# Altium project LimeSDR-USB_1v4.PrjPcb (part 5 of 7)

## Sheet 13_USB3_0_power.SchDoc: USB3.0 power
size A4; Organization: Lime Microsystems; Address1: Surrey Tech Centre; Address2: Guildford GU2 7YG; Address3: Surray; Address4: United Kingdom; Revision: v1.4; SheetNumber: 13; SheetTotal: 15
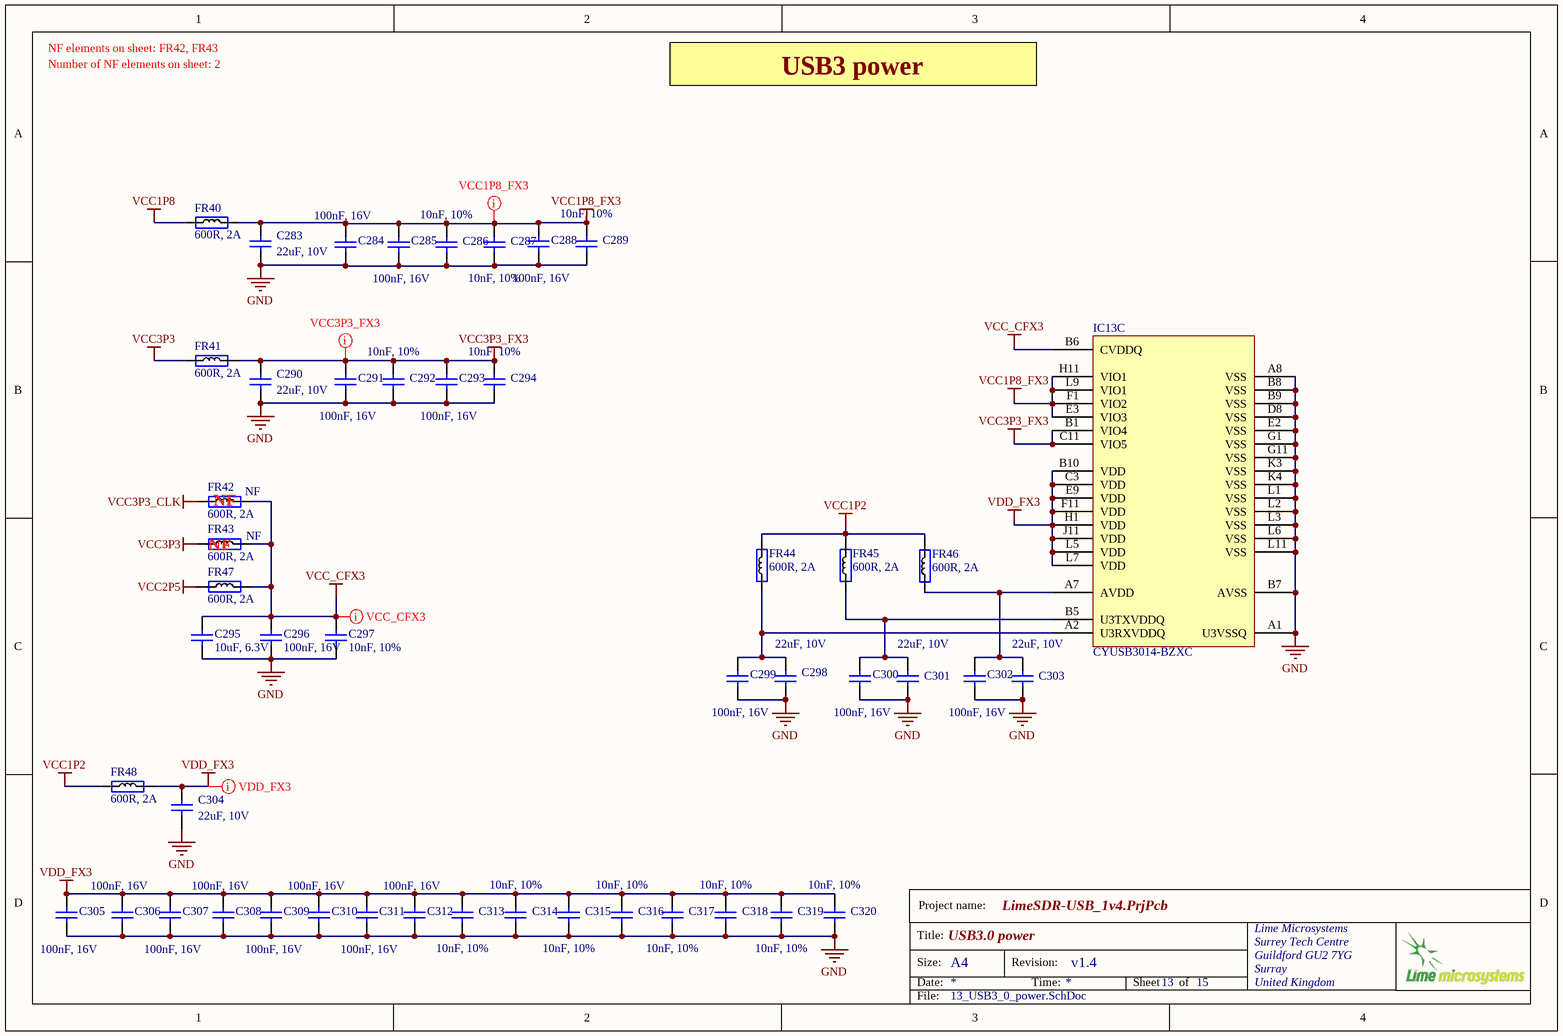
[diagram p12: 13_USB3_0_power.SchDoc]

### Parts
C283  22uF, 10V  [CAP0603]
C284  100nF, 16V  [CAP0402]
C285  100nF, 16V  [CAP0402]
C286  10nF, 10%  [CAP0402]
C287  10nF, 10%  [CAP0402]
C288  100nF, 16V  [CAP0402]
C289  10nF, 10%  [CAP0402]
C290  22uF, 10V  [CAP0603]
C291  100nF, 16V  [CAP0402]
C292  10nF, 10%  [CAP0402]
C293  100nF, 16V  [CAP0402]
C294  10nF, 10%  [CAP0402]
C295  10uF, 6.3V  [CAP0603]
C296  100nF, 16V  [CAP0402]
C297  10nF, 10%  [CAP0402]
C298  22uF, 10V  [CAP0603]
C299  100nF, 16V  [CAP0402]
C300  100nF, 16V  [CAP0402]
C301  22uF, 10V  [CAP0603]
C302  100nF, 16V  [CAP0402]
C303  22uF, 10V  [CAP0603]
C304  22uF, 10V  [CAP0603]
C305  100nF, 16V  [CAP0402]
C306  100nF, 16V  [CAP0402]
C307  100nF, 16V  [CAP0402]
C308  100nF, 16V  [CAP0402]
C309  100nF, 16V  [CAP0402]
C310  100nF, 16V  [CAP0402]
C311  100nF, 16V  [CAP0402]
C312  100nF, 16V  [CAP0402]
C313  10nF, 10%  [CAP0402]
C314  10nF, 10%  [CAP0402]
C315  10nF, 10%  [CAP0402]
C316  10nF, 10%  [CAP0402]
C317  10nF, 10%  [CAP0402]
C318  10nF, 10%  [CAP0402]
C319  10nF, 10%  [CAP0402]
C320  10nF, 10%  [CAP0402]
FR40  600R, 2A  [RES0805]
FR41  600R, 2A  [RES0805]
FR42  600R, 2A  Assembly Info: NF  [RES0805]
FR43  600R, 2A  Assembly Info: NF  [RES0805]
FR44  600R, 2A  [RES0805]
FR45  600R, 2A  [RES0805]
FR46  600R, 2A  [RES0805]
FR47  600R, 2A  [RES0805]
FR48  600R, 2A  [RES0805]
IC13  CYUSB3014-BZXC  [CYP-BZX121]  (part C of 3)

### Nets
GND: C283.1 C284.2 C285.2 C286.1 C287.1 C288.2 C289.1 C290.1 C291.2 C292.1 C293.2 C294.1 C295.1 C296.2 C297.1 C298.1 C299.2 C300.2 C301.1 C302.2 C303.1 C304.1 C305.2 C306.2 C307.2 C308.2 C309.2 C310.2 C311.2 C312.2 C313.1 C314.1 C315.1 C316.1 C317.1 C318.1 C319.1 C320.1 IC13.A1(U3VSSQ) IC13.A8(VSS) IC13.B7(AVSS) IC13.B8(VSS) IC13.B9(VSS) IC13.D8(VSS) IC13.E2(VSS) IC13.G1(VSS) IC13.G11(VSS) IC13.K3(VSS) IC13.K4(VSS) IC13.L1(VSS) IC13.L2(VSS) IC13.L3(VSS) IC13.L6(VSS) IC13.L11(VSS)
VCC1P2: FR44.2 FR45.2 FR46.2 FR48.1
VCC1P8: FR40.1
VCC1P8_FX3: C283.2 C284.1 C285.1 C286.2 C287.2 C288.1 C289.2 FR40.2 IC13.E3(VIO3) IC13.F1(VIO2) IC13.H11(VIO1) IC13.L9(VIO1)
VCC2P5: FR47.2
VCC3P3: FR41.1 FR43.2
VCC3P3_CLK: FR42.2
VCC3P3_FX3: C290.2 C291.1 C292.2 C293.1 C294.2 FR41.2 IC13.B1(VIO4) IC13.C11(VIO5)
VCC_CFX3: C295.2 C296.1 C297.2 FR42.1 FR43.1 FR47.1 IC13.B6(CVDDQ)
VDD_FX3: C304.2 C305.1 C306.1 C307.1 C308.1 C309.1 C310.1 C311.1 C312.1 C313.2 C314.2 C315.2 C316.2 C317.2 C318.2 C319.2 C320.2 FR48.2 IC13.B10(VDD) IC13.C3(VDD) IC13.E9(VDD) IC13.F11(VDD) IC13.H1(VDD) IC13.J11(VDD) IC13.L5(VDD) IC13.L7(VDD)
NetC298_2: C298.2 C299.1 FR44.1 IC13.A2(U3RXVDDQ)
NetC300_1: C300.1 C301.2 FR45.1 IC13.B5(U3TXVDDQ)
NetC302_1: C302.1 C303.2 FR46.1 IC13.A7(AVDD)

### Layout directives
net class VCC1P8_FX3: VCC1P8_FX3
net class VCC3P3_FX3: VCC3P3_FX3
net class VCC_CFX3: VCC_CFX3
net class VDD_FX3: VDD_FX3

### Notes on the sheet
- Number of NF elements on sheet: 2
- NF elements on sheet: FR42, FR43
- USB3 power
- (near FR42) NF
- (near FR43) NF
- Project name:
- Title:
- Size:
- Date:
- A4
- Revision:
- Time:
- Sheet
- of
- File:

### Library data of the parts
C283 C290 C298 C301 C303 C304 = Cap_0603: Manufacturer Part Number 1: C1608X5R1A226M080AC; Part Description: 22µF ±20% 10V X5R Ceramic Capacitor -55°C ~ 85°C Surface Mount, MLCC 0603 (1608 Metric) 0.063" L x 0.031" W (1.60mm x 0.80mm); Brand: TDK; Temperature Coefficient / Code: +/- 15 %; Tolerance: 20 %; Type: Multilayer Ceramic Chip Capacitor; Supplier 1: Mouser; Supplier Part Number 1: 810-C1608X5R1A226M; Package / Case: 0603 (1608 metric); Category: Multilayer Ceramic Capacitors MLCC - SMD/SMT; Capacitance: 22 uF; Operating Temperature Range: - 55 C to + 85 C; Case Code - in: 0603; Voltage Rating DC: 10 V; Case Code - mm: 1608; Value: 22uF, 10V; Manufacturer: TDK
C284 C285 C288 C291 C293 C296 C299 C300 C302 C305-C312 = Cap_0603: Manufacturer Part Number 1: GRM155R71C104KA88D; Part Description: 0.10µF ±10% 16V X7R Ceramic Capacitor -55°C ~ 125°C Surface Mount, MLCC 0402 (1005 Metric) 0.039" L x 0.020" W (1.00mm x 0.50mm); Brand: Murata Electronics; Tolerance: 10 %; Type: General Purpose MLCC; Capacitance: 0.1 uF; Temperature Coefficient / Code: +/- 15 %; Supplier 1: Mouser; Supplier Part Number 1: 81-GRM155R71C104KA88; Case Code - in: 0402; Manufacturer: Murata Electronics; Category: Multilayer Ceramic Capacitors MLCC - SMD/SMT; Voltage Rating DC: 16 V; Value: 100nF, 16V; Manufacturer Part Number: GRM155R71C104KA88D
C286 C287 C289 C292 C294 C297 C313-C320 = Cap_0603: Part Description: 10000pF ±10% 50V X7R Ceramic Capacitor -55°C ~ 125°C Surface Mount, MLCC 0402 (1005 Metric) 0.039" L x 0.020" W (1.00mm x 0.50mm); Manufacturer: Yageo; Capacitance: 10000pF; Voltage - Rated: 50V; Supplier 1: Digi-Key; Supplier Part Number 1: 311-1349-2-ND; Category: Capacitors; Package / Case: 0402 (1005 Metric); Tolerance: ±10%; Value: 10nF, 10%
C295 = Cap_0603: Manufacturer Part Number 1: CC0603MRX5R5BB106; Part Description: 10µF ±20% 6.3V X5R Ceramic Capacitor -55°C ~ 85°C Surface Mount, MLCC 0603 (1608 Metric) 0.063" L x 0.031" W (1.60mm x 0.80mm); Manufacturer: Yageo; Capacitance: 10µF; Tolerance: ±20%; Supplier 1: Digi-Key; Supplier Part Number 1: 311-1448-2-ND; Package / Case: 0603 (1608 Metric); Category: Capacitors; Voltage - Rated: 6.3V; Value: 10uF, 6.3V
FR40-FR48 = Ferrite: Manufacturer Part Number 1: MPZ2012S601AT000; Manufacturer: TDK Corporation; Part Description: FERRITE BEAD 600 OHM 0805 1LN; DC Resistance (DCR): 100 mOhm Max; Filter Type: Differential Mode - Single; Impedance @ Frequency: 600 Ohm @ 100MHz; Supplier 1: Digi-Key; Supplier Part Number 1: 445-2206-2-ND; Value: 600R, 2A; Category: Filters; Current Rating: 2A; Height (Max): 0.041" (1.05mm); Mounting Type: Surface Mount; Package / Case: 0805 (2012 Metric); Packaging: Tape & Reel (TR); RoHS: RoHS Compliant; Size / Dimension: 0.079" L x 0.049" W (2.00mm x 1.25mm)
IC13 = CYUSB3014-BZXC: EZ-USB(R) FX3: SuperSpeed USB Controller, 512 KB, 60 I/Os, 0 to 70 degC, 121-Pin FBGA (BZX121); Manufacturer: Cypress Semiconductor Corp; CPU Core: ARM926 EJ-S; Max. Operating Voltage (V): 1.25; Memory Architecture: SRAM; Memory Size (KB): 512; Min. Operating Voltage (V): 1.15; No. of I/Os: 60; DatasheetVersion: Rev. *O; PackageVersion: Rev. *D; PackageReference: BZX121; PackageDescription: 121-Ball FBGA, Body 10 x 10 mm, Pitch 0.8 mm; Supplier 1: Digi-Key; Supplier Part Number 1: 428-3182-ND; Supplier 2: Farnell; Supplier Part Number 2: 2355789; Supplier 3: Newark; Supplier Part Number 3: 54W7901; Supplier 4: Mouser; Supplier Part Number 4: 727-CYUSB3014-BZXC; Max. Operating Temp. (degreesC): 70; Min. Operating Temp. (degreesC): 0; RoHS: Pb-Free; Mounting Technology: Surface Mount; Code_JEDEC: PUB 95; PartNumber: CYUSB3014-BZXC; ComponentLink1Description: Manufacturer URL; ComponentLink1URL: http://www.cypress.com/; ComponentLink2Description: Datasheet; ComponentLink2URL: http://www.cypress.com/?docID=49087; ComponentLink3Description: Package Specification; ComponentLink3URL: http://www.cypress.com/?docID=45795; Part Description: EZ-USB(R) FX3: SuperSpeed USB Controller, 512 KB, 60 I/Os, 0 to 70 degC, 121-Pin FBGA (BZX121)

## Sheet 14_Clocks.SchDoc: Clocks
size A3; Organization: Lime Microsystems; Address1: Surrey Tech Centre; Address2: Guildford GU2 7YG; Address3: Surrey; Address4: United Kingdom; Revision: v1.4; SheetNumber: 14; SheetTotal: 15
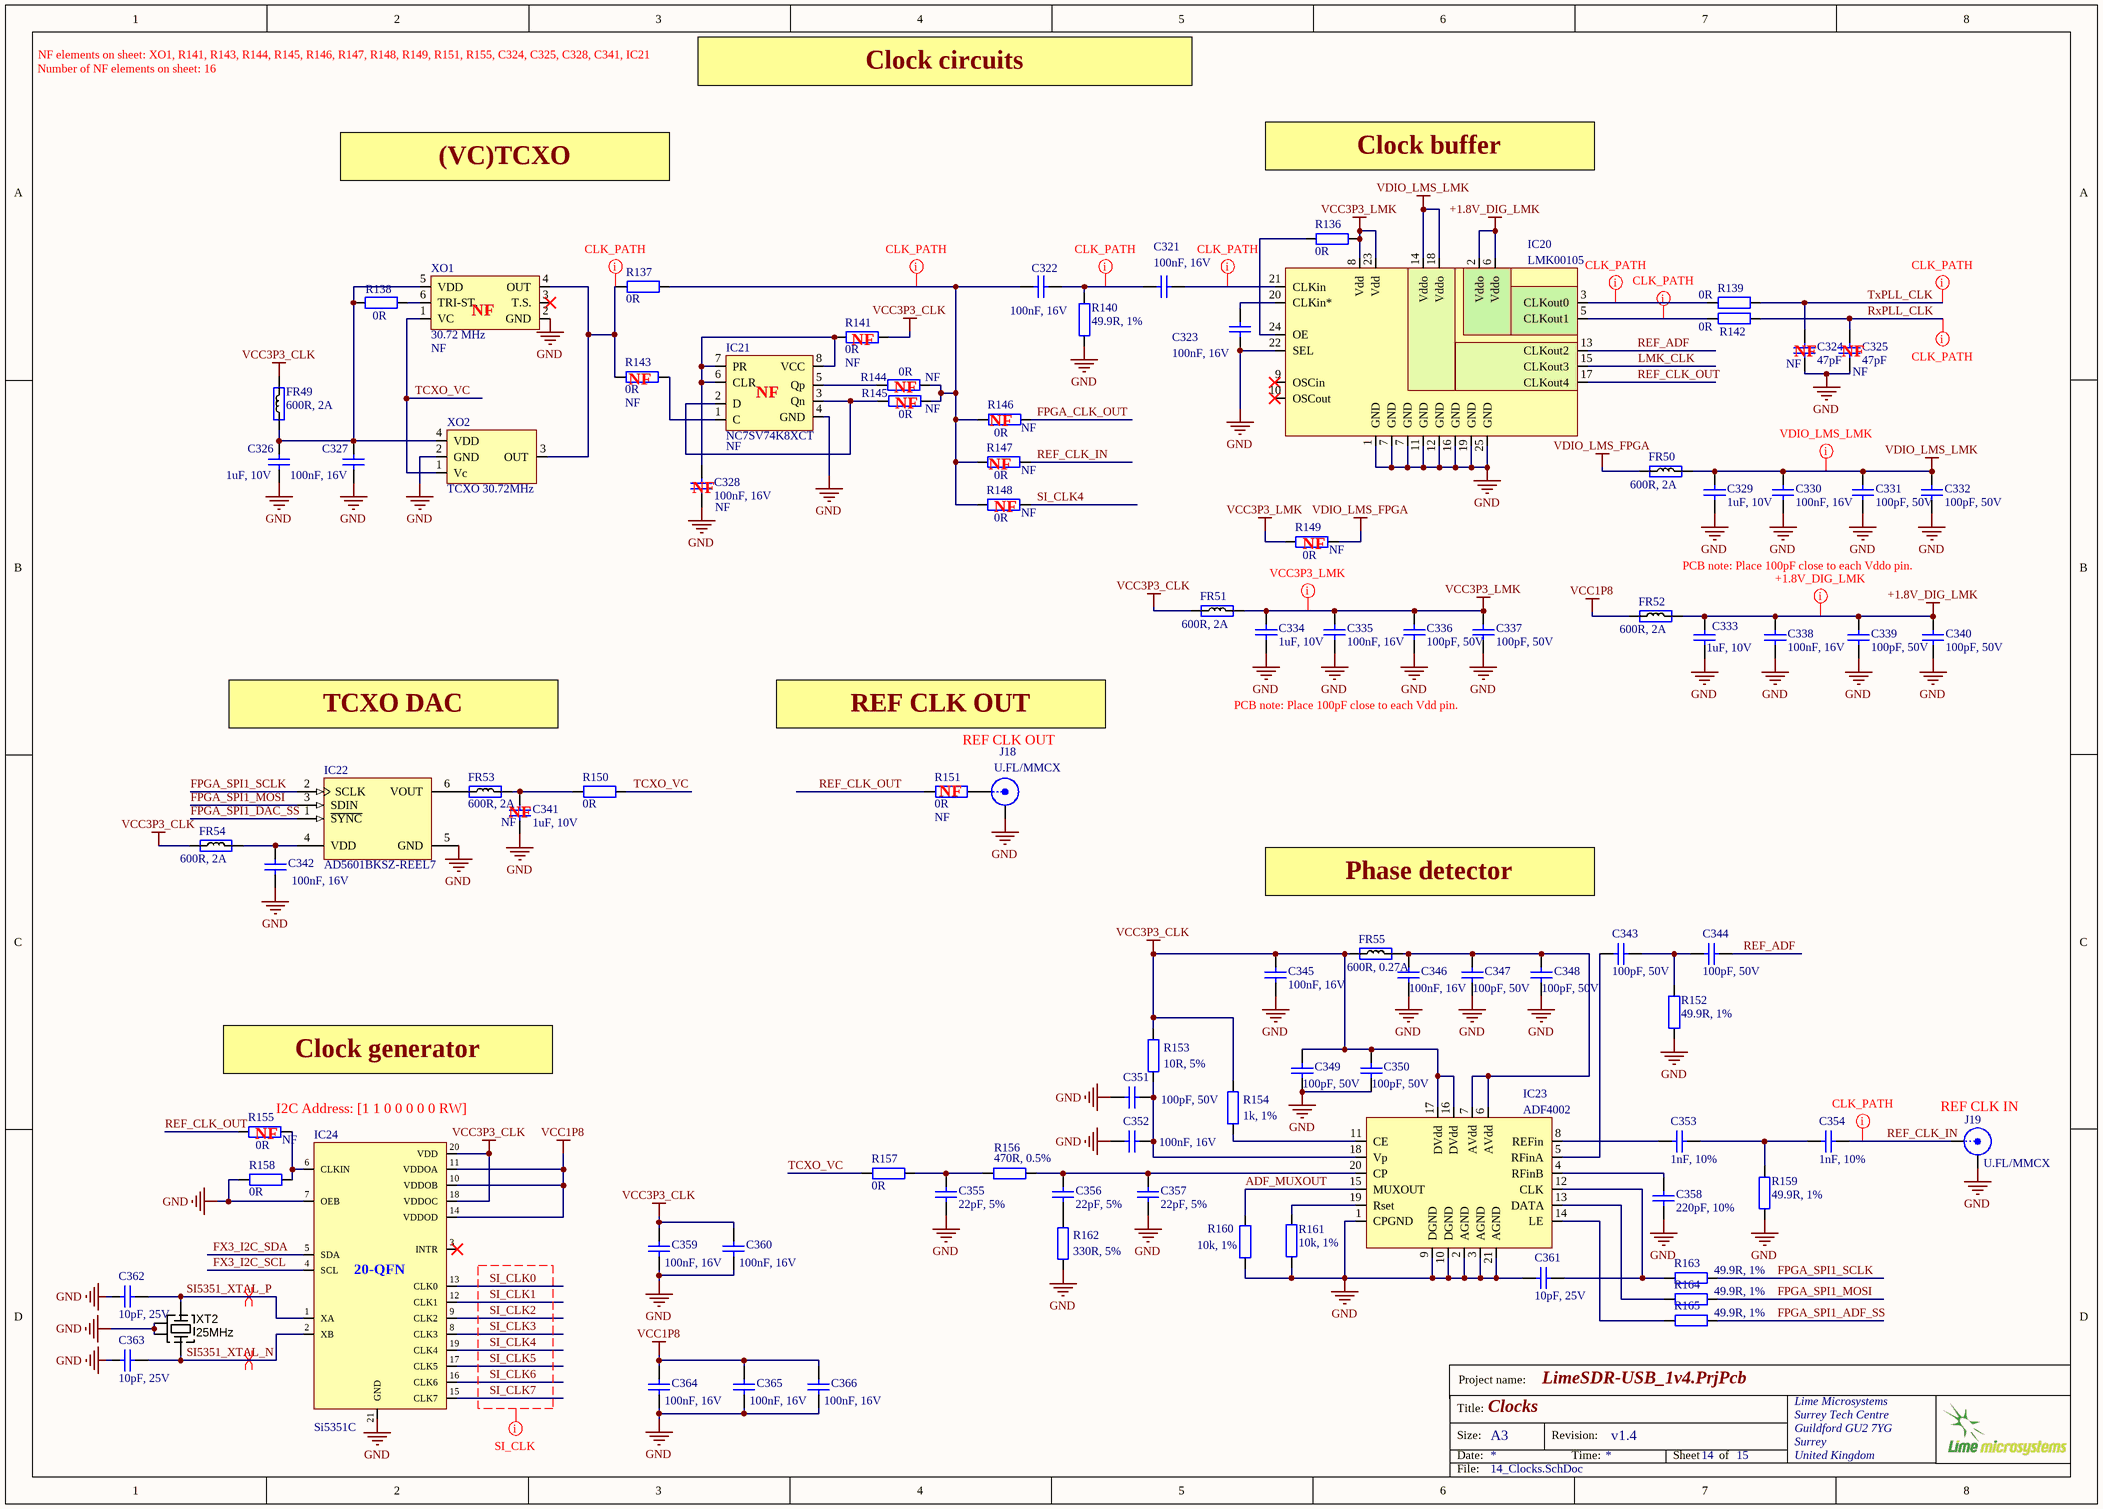
[diagram p13: 14_Clocks.SchDoc]

### Parts
C321  100nF, 16V  [CAP0402]
C322  100nF, 16V  [CAP0402]
C323  100nF, 16V  [CAP0402]
C324  47pF  Assembly Info: NF  [CAP0402]
C325  47pF  Assembly Info: NF  [CAP0402]
C326  1uF, 10V  [CAP0402]
C327  100nF, 16V  [CAP0402]
C328  100nF, 16V  Assembly Info: NF  [CAP0402]
C329  1uF, 10V  [CAP0402]
C330  100nF, 16V  [CAP0402]
C331  100pF, 50V  [CAP0402]
C332  100pF, 50V  [CAP0402]
C333  1uF, 10V  [CAP0402]
C334  1uF, 10V  [CAP0402]
C335  100nF, 16V  [CAP0402]
C336  100pF, 50V  [CAP0402]
C337  100pF, 50V  [CAP0402]
C338  100nF, 16V  [CAP0402]
C339  100pF, 50V  [CAP0402]
C340  100pF, 50V  [CAP0402]
C341  1uF, 10V  Assembly Info: NF  [CAP0402]
C342  100nF, 16V  [CAP0402]
C343  100pF, 50V  [CAP0402]
C344  100pF, 50V  [CAP0402]
C345  100nF, 16V  [CAP0402]
C346  100nF, 16V  [CAP0402]
C347  100pF, 50V  [CAP0402]
C348  100pF, 50V  [CAP0402]
C349  100pF, 50V  [CAP0402]
C350  100pF, 50V  [CAP0402]
C351  100pF, 50V  [CAP0402]
C352  100nF, 16V  [CAP0402]
C353  1nF, 10%  [CAP0402]
C354  1nF, 10%  [CAP0402]
C355  22pF, 5%  [CAP0402]
C356  22pF, 5%  [CAP0402]
C357  22pF, 5%  [CAP0402]
C358  220pF, 10%  [CAP0402]
C359  100nF, 16V  [CAP0402]
C360  100nF, 16V  [CAP0402]
C361  10pF, 25V  [CAP0402]
C362  10pF, 25V  [CAP0402]
C363  10pF, 25V  [CAP0402]
C364  100nF, 16V  [CAP0402]
C365  100nF, 16V  [CAP0402]
C366  100nF, 16V  [CAP0402]
FR49  600R, 2A  [RES0805]
FR50  600R, 2A  [RES0805]
FR51  600R, 2A  [RES0805]
FR52  600R, 2A  [RES0805]
FR53  600R, 2A  [RES0805]
FR54  600R, 2A  [RES0805]
FR55  600R, 0.27A  [RES0201]
IC20  LMK00105  [LMK00105SQ]
IC21  NC7SV74K8XCT  Assembly Info: NF  [NC7SV74K8XCT]
IC22  AD5601BKSZ-REEL7  [AD5601_SOT23-6]
IC23  ADF4002  [ADF4002]
IC24  Si5351C  [Si5351C_20QFN]
J18  U.FL/MMCX  [MMCX_UFL_conn_u]
J19  U.FL/MMCX  [MMCX_UFL_conn_u]
R136  0R  [RES0402]
R137  0R  [RES0402]
R138  0R  [RES0402]
R139  0R  [RES0402]
R140  49.9R, 1%  [RES0402]
R141  0R  Assembly Info: NF  [RES0402]
R142  0R  [RES0402]
R143  0R  Assembly Info: NF  [RES0402]
R144  0R  Assembly Info: NF  [RES0402]
R145  0R  Assembly Info: NF  [RES0402]
R146  0R  Assembly Info: NF  [RES0402]
R147  0R  Assembly Info: NF  [RES0402]
R148  0R  Assembly Info: NF  [RES0402]
R149  0R  Assembly Info: NF  [RES0402]
R150  0R  [RES0402]
R151  0R  Assembly Info: NF  [RES0402]
R152  49.9R, 1%  [RES0402]
R153  10R, 5%  [RES0402]
R154  1k, 1%  [RES0402]
R155  0R  Assembly Info: NF  [RES0402]
R156  470R, 0.5%  [RES0402]
R157  0R  [RES0402]
R158  0R  [RES0402]
R159  49.9R, 1%  [RES0402]
R160  10k, 1%  [RES0402]
R161  10k, 1%  [RES0402]
R162  330R, 5%  [RES0402]
R163  49.9R, 1%  [RES0402]
R164  49.9R, 1%  [RES0402]
R165  49.9R, 1%  [RES0402]
XO1  30.72 MHz  Assembly Info: NF  [RAKON_RPT7050A]
XO2  TCXO 30.72MHz  [RAKON_TXCO]
XT2  25MHz  [CRYSTAL_4-LCC]

### Nets
+1.8V_DIG_LMK: C333.2 C338.2 C339.2 C340.2 FR52.2 IC20.2(Vddo) IC20.6(Vddo)
GND: C323.1 C324.1 C325.1 C326.1 C327.1 C328.1 C329.1 C330.1 C331.1 C332.1 C333.1 C334.1 C335.1 C336.1 C337.1 C338.1 C339.1 C340.1 C341.1 C342.2 C345.1 C346.1 C347.2 C348.2 C349.2 C350.2 C351.1 C352.2 C355.1 C357.1 C358.2 C359.2 C360.2 C361.1 C362.1 C363.1 C364.2 C365.2 C366.2 IC20.1(GND) IC20.7(GND) IC20.11(GND) IC20.12(GND) IC20.16(GND) IC20.19(GND) IC20.22(SEL) IC20.25(GND) IC21.4(GND) IC22.5(GND) IC23.1(CPGND) IC23.2(AGND) IC23.3(AGND) IC23.9(DGND) IC23.10(DGND) IC23.21(AGND) IC24.7(OEB) IC24.21(GND) J18.2(Y) J19.2(Y) R140.1 R152.1 R158.2 R159.1 R160.2 R161.2 R162.1 XO1.2(GND) XO2.2(GND) XT2.2(GND) XT2.4(GND)
VCC1P8: C364.1 C365.1 C366.1 FR52.1 IC24.10(VDDOB) IC24.11(VDDOA) IC24.14(VDDOD)
VCC3P3_CLK: C345.2 C349.1 C350.1 C359.1 C360.1 FR49.2 FR51.1 FR54.1 FR55.1 IC23.16(DVdd) IC23.17(DVdd) IC24.18(VDDOC) IC24.20(VDD) R141.1 R153.2 R154.2
VCC3P3_LMK: C334.2 C335.2 C336.2 C337.2 FR51.2 IC20.8(Vdd) IC20.23(Vdd) R136.2 R149.1
VDIO_LMS_FPGA: FR50.1 R149.2
VDIO_LMS_LMK: C329.2 C330.2 C331.2 C332.2 FR50.2 IC20.14(Vddo) IC20.18(Vddo)
ADF_MUXOUT: IC23.15(MUXOUT) R160.1
FPGA_CLK_OUT: R146.1
FPGA_SPI1_ADF_SS: R165.1
FPGA_SPI1_DAC_SS: IC22.1(~{SYNC})
FPGA_SPI1_MOSI: IC22.3(SDIN) R164.1
FPGA_SPI1_SCLK: IC22.2(SCLK) R163.1
FX3_I2C_SCL: IC24.4(SCL)
FX3_I2C_SDA: IC24.5(SDA)
LMK_CLK: IC20.15(CLKout3)
REF_ADF: C344.2 IC20.13(CLKout2)
REF_CLK_IN: C354.1 J19.1(X) R147.2
REF_CLK_OUT: IC20.17(CLKout4) R151.2 R155.1
RxPLL_CLK: C325.2 R142.1
SI5351_XTAL_N: C363.2 IC24.2(XB) XT2.3(X)
SI5351_XTAL_P: C362.2 IC24.1(XA) XT2.1(X)
SI_CLK0: IC24.13(CLK0)
SI_CLK1: IC24.12(CLK1)
SI_CLK2: IC24.9(CLK2)
SI_CLK3: IC24.8(CLK3)
SI_CLK4: IC24.19(CLK4) R148.2
SI_CLK5: IC24.17(CLK5)
SI_CLK6: IC24.16(CLK6)
SI_CLK7: IC24.15(CLK7)
TCXO_VC: R150.1 R157.2 XO1.1(VC) XO2.1(Vc)
TxPLL_CLK: C324.2 R139.1
NetC321_1: C321.1 IC20.21(CLKin)
NetC321_2: C321.2 C322.1 R140.2
NetC322_2: C322.2 R137.1 R144.1 R145.1 R146.2 R147.1 R148.1
NetC323_2: C323.2 IC20.20(CLKin*)
NetC326_2: C326.2 C327.2 FR49.1 R138.2 XO1.5(VDD) XO2.4(VDD)
NetC328_2: C328.2 IC21.6(CLR) IC21.7(PR) IC21.8(VCC) R141.2
NetC341_2: C341.2 FR53.2 R150.2
NetC342_1: C342.1 FR54.2 IC22.4(VDD)
NetC343_1: C343.1 IC23.5(RFinA)
NetC343_2: C343.2 C344.1 R152.2
NetC346_2: C346.2 C347.1 C348.1 FR55.2 IC23.6(AVdd) IC23.7(AVdd)
NetC351_2: C351.2 C352.1 IC23.18(Vp) R153.1
NetC353_1: C353.1 C354.2 R159.2
NetC353_2: C353.2 IC23.8(REFin)
NetC355_2: C355.2 R156.2 R157.1
NetC356_1: C356.1 R162.2
NetC356_2: C356.2 C357.2 IC23.20(CP) R156.1
NetC358_1: C358.1 IC23.4(RFinB)
NetC361_2: C361.2 IC23.12(CLK) R163.2
NetFR53_1: FR53.1 IC22.6(VOUT)
NetIC20_3: IC20.3(CLKout0) R139.2
NetIC20_5: IC20.5(CLKout1) R142.2
NetIC20_24: IC20.24(OE) R136.1
NetIC21_1: IC21.1(C) R143.1
NetIC21_2: IC21.2(D) IC21.3(Qn) R145.2
NetIC21_5: IC21.5(Qp) R144.2
NetIC23_11: IC23.11(CE) R154.1
NetIC23_13: IC23.13(DATA) R164.2
NetIC23_14: IC23.14(LE) R165.2
NetIC23_19: IC23.19(Rset) R161.1
NetIC24_6: IC24.6(CLKIN) R155.2 R158.1
NetJ18_1: J18.1(X) R151.1
NetR137_2: R137.2 R143.2 XO1.4(OUT) XO2.3(OUT)
NetR138_1: R138.1 XO1.6(TRI-ST.)

Not connected (* = marked no-connect by the designer): IC20 9(OSCin)* 10(OSCout)*; IC24 3(INTR)*; XO1 3(T.S.)*

### Layout directives
net class CLK_PATH: NetC321_1, NetC321_2, NetC322_2, NetIC20_3, NetIC20_5, NetR137_2, REF_CLK_IN, RxPLL_CLK, TxPLL_CLK
net class SI_CLK: SI_CLK0, SI_CLK1, SI_CLK2, SI_CLK3, SI_CLK4, SI_CLK5, SI_CLK6, SI_CLK7
differential pair: SI5351_XTAL_N, SI5351_XTAL_P
net class VDIO_LMS_LMK: VDIO_LMS_LMK
net class VCC3P3_LMK: VCC3P3_LMK
net class +1.8V_DIG_LMK: +1.8V_DIG_LMK

### Notes on the sheet
- Number of NF elements on sheet: 16
- NF elements on sheet: XO1, R141, R143, R144, R145, R146, R147, R148, R149, R151, R155, C324, C325, C328, C341, IC21
- Clock circuits
- (VC)TCXO
- Clock buffer
- (near XO1) NF
- (near R143) NF
- (near R141) NF
- (near C324) NF
- (near C325) NF
- (near IC21) NF
- NF
- (near R145) NF
- (near R146) NF
- (near C328) NF
- (near R147) NF
- (near R148) NF
- (near R149) NF
- PCB note: Place 100pF close to each Vddo pin.
- PCB note: Place 100pF close to each Vdd pin.
- TCXO DAC
- REF CLK OUT
- (near C341) NF
- (near R151) NF
- Phase detector
- Clock generator
- (near R155) I2C Address: [1 1 0 0 0 0 0 RW]
- (near J19) REF CLK IN
- (near R155) NF
- Project name:
- Title:
- Size:
- Date:
- A3
- Revision:
- Time:
- Sheet
- of
- File:
- (in symbol Si5351C) 20-QFN

### Library data of the parts
C321-C323 C327 C328 C330 C335 C338 C345 C346 C352 = Cap_0402: Manufacturer: Murata Electronics; Manufacturer Part Number: GRM155R71C104KA88D; Part Description: 0.10µF ±10% 16V X7R Ceramic Capacitor -55°C ~ 125°C Surface Mount, MLCC 0402 (1005 Metric) 0.039" L x 0.020" W (1.00mm x 0.50mm); Tolerance: 10 %; Type: General Purpose MLCC; Capacitance: 0.1 uF; Case Length: 1 mm; Dielectric: X7R; Case Height: 0.5 mm; Temperature Coefficient / Code: +/- 15 %; Value: 100nF, 16V; Supplier 1: Mouser; Supplier Part Number 1: 81-GRM155R71C104KA88; Case Code - in: 0402; RoHS: RoHS Compliant; Operating Temperature Range: - 55 C to + 125 C; Series: GRM; Termination Style: SMD/SMT; Package / Case: 0402 (1005 metric); Voltage Rating DC: 16 V; Maximum Operating Temperature: + 125 C; Case Code - mm: 1005; Minimum Operating Temperature: - 55 C; Product Category: Low & Medium Capacitance SMD Ceramic Chip Capacitors; Packaging: Reel; Product: General Type MLCCs; Category: Multilayer Ceramic Capacitors MLCC - SMD/SMT; Brand: Murata Electronics; Case Width: 0.5 mm; RoHS - Mouser: Y; Standard Pack Qty: 10000; Minimum Order Quantity: 1; Reeling: True; Manufacturer Part Number 1: GRM155R71C104KA88D
C324 C325 = Cap_0402: Manufacturer Part Number 1: C1005C0G1H470F050BA; Manufacturer: TDK Corporation; Part Description: 47pF ±1% 50V C0G, NP0 Ceramic Capacitor -55°C ~ 125°C Surface Mount, MLCC 0402 (1005 Metric) 0.039" L x 0.020" W (1.00mm x 0.50mm); Voltage - Rated: 50V; Temperature Coefficient: C0G, NP0; Tolerance: ±1%; Value: 47pF; Supplier 1: Digi-Key; Supplier Part Number 1: 445-5361-1-ND; Package / Case: 0402 (1005 Metric); Lead Spacing: -; Ratings: -; Mounting Type: Surface Mount, MLCC; Operating Temperature: -55°C ~ 125°C; Thickness (Max): 0.022" (0.55mm); Capacitance: 47pF; Packaging: Cut Tape (CT); Features: -; Applications: General Purpose; Lead Style: -; Size / Dimension: 0.039" L x 0.020" W (1.00mm x 0.50mm); Height - Seated (Max): -; RoHS: RoHS Compliant; Category: Capacitors
C326 C329 C333 C334 C341 = Cap_0402: Manufacturer Part Number 1: GRM155R61A105KE15J; Manufacturer: TDK; Part Description: 1µF ±10% 10V X5R Ceramic Capacitor -55°C ~ 85°C Surface Mount, MLCC 0402 (1005 Metric) 0.039" L x 0.020" W (1.00mm x 0.50mm); Voltage Rating: 10; Capacitance Tolerance: ± 10%; Product Range: TDK - C Series; Ceramic Capacitor Case: 0402 [1005 Metric]; Capacitance: 1; Dielectric Characteristic: X6; Value: 1uF, 10V; Supplier 1: Newark; Supplier Part Number 1: 490-6298-2-ND; MSL: -; RoHS: YES
C331 C332 C336 C337 C339 C340 = Cap_0402: Manufacturer Part Number 1: CC0402JRNPO9BN101; Manufacturer: Yageo; Part Description: 100pF ±5% 50V C0G, NP0 Ceramic Capacitor -55°C ~ 125°C Surface Mount, MLCC 0402 (1005 Metric) 0.039" L x 0.020" W (1.00mm x 0.50mm); Temperature Coefficient: C0G, NP0; Tolerance: ±5%; Value: 100pF, 50V; Supplier 1: Digi-Key; Supplier Part Number 1: 311-1024-1-ND; RoHS: RoHS Compliant; Category: Capacitors; Applications: General Purpose; Mounting Type: Surface Mount, MLCC; Capacitance: 100pF; Ratings: -; Packaging: Cut Tape (CT); Voltage - Rated: 50V; Size / Dimension: 0.039" L x 0.020" W (1.00mm x 0.50mm); Height - Seated (Max): -; Package / Case: 0402 (1005 Metric); Operating Temperature: -55°C ~ 125°C; Features: -; Lead Spacing: -; Lead Style: -; Thickness (Max): 0.022" (0.55mm)
C342 C359 C360 C364-C366 = Cap_0603: as C284 on sheet 13_USB3_0_power; Supplier 1: Mouser; Supplier Part Number 1: 81-GRM155R71C104KA88; Case Code - in: 0402; Manufacturer: Murata Electronics; Category: Multilayer Ceramic Capacitors MLCC - SMD/SMT; Voltage Rating DC: 16 V; Value: 100nF, 16V; Manufacturer Part Number: GRM155R71C104KA88D
C343 C344 C347-C351 = Cap_0402: Manufacturer: Yageo; Manufacturer Part Number 1: CC0402JRNPO9BN101; Part Description: 100pF ±5% 50V C0G, NP0 Ceramic Capacitor -55°C ~ 125°C Surface Mount, MLCC 0402 (1005 Metric) 0.039" L x 0.020" W (1.00mm x 0.50mm); Temperature Coefficient: C0G, NP0; Tolerance: ±5%; Value: 100pF, 50V; Supplier 1: Digi-Key; Supplier Part Number 1: 311-1024-1-ND; Category: Capacitors; Features: -; Operating Temperature: -55°C ~ 125°C; Capacitance: 100pF; Thickness (Max): 0.022" (0.55mm); RoHS: RoHS Compliant; Voltage - Rated: 50V; Lead Style: -; Ratings: -; Size / Dimension: 0.039" L x 0.020" W (1.00mm x 0.50mm); Height - Seated (Max): -; Applications: General Purpose; Package / Case: 0402 (1005 Metric); Lead Spacing: -; Packaging: Tape & Reel (TR); Mounting Type: Surface Mount, MLCC
C353 C354 = Cap_0402: Manufacturer Part Number 1: GCM155R71H102KA37D; Part Description: 1000pF ±10% 50V X7R Ceramic Capacitor -55°C ~ 125°C Surface Mount, MLCC 0402 (1005 Metric) 0.039" L x 0.020" W (1.00mm x 0.50mm); Capacitance: 1000 pF; Type: Automotive Ultra Small MLCC; Brand: Murata Electronics; Case Height: 0.5 mm; Case Length: 1 mm; Dielectric: X7R; Voltage Rating DC: 50 V; Temperature Coefficient / Code: +/- 15 %; Value: 1nF, 10%; Supplier 1: Mouser; Supplier Part Number 1: 81-GCM155R71H102KA7D; Case Code - in: 0402; Package / Case: 0402 (1005 metric); Tolerance: 10 %; Termination Style: SMD/SMT; Packaging: Reel; Operating Temperature Range: - 55 C to + 125 C; Maximum Operating Temperature: + 125 C; Manufacturer: Murata Electronics; Category: Multilayer Ceramic Capacitors MLCC - SMD/SMT; RoHS: RoHS Compliant; Series: GCM; Case Width: 0.5 mm; Case Code - mm: 1005; Product: Automotive MLCCs; Standard Pack Qty: 10000; Reeling: True; RoHS - Mouser: Y; Minimum Order Quantity: 1; Product Category: Automotive Ceramic Chip Capacitors; Minimum Operating Temperature: - 55 C
C355-C357 = Cap_0402: Manufacturer: Yageo; Manufacturer Part Number 1: CC0402JRNPO9BN220; Part Description: 22pF ±5% 50V C0G, NP0 Ceramic Capacitor -55°C ~ 125°C Surface Mount, MLCC 0402 (1005 Metric) 0.039" L x 0.020" W (1.00mm x 0.50mm); Voltage - Rated: 50V; Temperature Coefficient: C0G, NP0; Value: 22pF, 5%; Supplier 1: Digi-Key; Supplier Part Number 1: 311-1018-2-ND; Tolerance: ±5%; Category: Capacitors; Packaging: Tape & Reel (TR); RoHS: RoHS Compliant; Capacitance: 22pF; Operating Temperature: -55°C ~ 125°C; Mounting Type: Surface Mount, MLCC; Height - Seated (Max): -; Size / Dimension: 0.039" L x 0.020" W (1.00mm x 0.50mm); Ratings: -; Applications: General Purpose; Thickness (Max): 0.022" (0.55mm); Lead Spacing: -; Lead Style: -; Features: -; Package / Case: 0402 (1005 Metric)
C358 = Cap_0402: Manufacturer Part Number 1: CC0402KRX7R9BB221; Manufacturer: Yageo; Part Description: 220pF ±10% 50V X7R Ceramic Capacitor -55°C ~ 125°C Surface Mount, MLCC 0402 (1005 Metric) 0.039" L x 0.020" W (1.00mm x 0.50mm); Temperature Coefficient: X7R; Voltage - Rated: 50V; Value: 220pF, 10%; Supplier 1: Digi-Key; Supplier Part Number 1: 311-1035-2-ND; Category: Capacitors; Ratings: -; RoHS: RoHS Compliant; Packaging: Tape & Reel (TR); Mounting Type: Surface Mount, MLCC; Applications: General Purpose; Capacitance: 220pF; Tolerance: ±10%; Operating Temperature: -55°C ~ 125°C; Package / Case: 0402 (1005 Metric); Lead Spacing: -; Size / Dimension: 0.039" L x 0.020" W (1.00mm x 0.50mm); Thickness (Max): 0.022" (0.55mm); Height - Seated (Max): -; Lead Style: -; Features: -
C361 = Cap_0402: Manufacturer Part Number 1: 04023A100JAT2A; Manufacturer: AVX; Part Description: 10pF ±5% 25V C0G, NP0 Ceramic Capacitor -55°C ~ 125°C Surface Mount, MLCC 0402 (1005 Metric) 0.039" L x 0.020" W (1.00mm x 0.50mm); Capacitance Tolerance: ± 5%; Voltage Rating: 25; Ceramic Capacitor Case: 0402 [1005 Metric]; Capacitor Case Style: 0402 [1005 Metric]<!--FANDB--><div class="features-and-benefits-container"></div>; Dielectric Characteristic: C0G / NP0; SVHC: No SVHC (16-Jun-2014); Capacitance: 10; Value: 10pF, 25V; Supplier 1: Farnell; Supplier Part Number 1: 2332478RL; Product Range: -; RoHS: YES; Operating Temperature Min: -55; Operating Temperature Max: 125; Capacitance Tolerance ±: ± 5%; MSL: MSL 1 - Unlimited; Packaging: Cut Tape
C362 C363 = Cap_0402: Manufacturer: AVX; Part Description: 10pF ±5% 25V C0G, NP0 Ceramic Capacitor -55°C ~ 125°C Surface Mount, MLCC 0402 (1005 Metric) 0.039" L x 0.020" W (1.00mm x 0.50mm); Capacitance: 10; Ceramic Capacitor Case: 0402 [1005 Metric]; Capacitance Tolerance: ± 5%; Supplier 1: Farnell; Supplier Part Number 1: 2332478RL; value: 10pF, 25V
FR49-FR54 = Ferrite: Manufacturer Part Number 1: MPZ2012S601AT000; Manufacturer: TDK Corporation; Part Description: FERRITE BEAD 600 OHM 0805 1LN; Filter Type: Differential Mode - Single; Impedance @ Frequency: 600 Ohm @ 100MHz; DC Resistance (DCR): 100 mOhm Max; Supplier 1: Digi-Key; Supplier Part Number 1: 445-2206-2-ND; Mounting Type: Surface Mount; RoHS: RoHS Compliant; Height (Max): 0.041" (1.05mm); Packaging: Tape & Reel (TR); Category: Filters; Current Rating: 2A; Package / Case: 0805 (2012 Metric); Size / Dimension: 0.079" L x 0.049" W (2.00mm x 1.25mm); Value: 600R, 2A
FR55 = Ferrite: Manufacturer Part Number 1: BK0603TS601-T; Manufacturer: Taiyo Yuden; Part Description: FERRITE BEAD 600 OHM 0201 1LN; DC Resistance (DCR): 750 mOhm Max; Filter Type: Differential Mode - Single; Impedance @ Frequency: 600 Ohm @ 100MHz; Current Rating: 270mA; Supplier 1: Digi-Key; Supplier Part Number 1: 587-3277-1-ND; Size / Dimension: 0.024" L x 0.012" W (0.60mm x 0.30mm); Package / Case: 0201 (0603 Metric); Height (Max): 0.013" (0.33mm); Mounting Type: Surface Mount; Packaging: Cut Tape (CT); RoHS: RoHS Compliant; Category: Filters; Value: 600R, 0.27A
IC20 = LMK00105: Manufacturer: Texas Instruments; Manufacturer Part Number 1: LMK00105SQ/NOPB; Part Description: IC CLK BUFFER 2:5 200MHZ 24WQFN; Frequency - Max: 200MHz; Voltage - Supply: 2.375 V ~ 3.45 V; Input: HCSL, LVCMOS, LVDS, LVPECL, LVTTL, SSTL, Crystal; Differential - Input:Output: Yes/No; Supplier 1: Digi-Key; Type: Fanout Buffer (Distribution), Multiplexer, Translator; Category: Integrated Circuits (ICs); Operating Temperature: -40°C ~ 85°C; Package / Case: 24-WFQFN Exposed Pad; Supplier Device Package: 24-WQFN (4x4); Supplier Part Number 1: LMK00105SQ/NOPBCT-ND
IC21 = NC7SV74K8XCT: Manufacturer: Fairchild Semiconductor; Part Description: IC D-TYPE POS TRG SNGL US8; Max Propagation Delay @ V, Max CL: 2.8ns @ 3.3V, 30pF; Frequency - Clock: 200MHz; Current - Output High, Low: 24mA, 24mA; Current - Quiescent: 0.9µA; Number of Bits per Element: 1; Trigger Type: Positive Edge; Output Type: Differential; Function: Set(Preset) and Reset; Input Capacitance: 2pF; Voltage - Supply: 0.9 V ~ 3.6 V; Supplier 1: Digi-Key; Operating Temperature: -40°C ~ 85°C (TA); Mounting Type: Surface Mount; Package / Case: 8-VFSOP (0.091", 2.30mm Width); Packaging: Cut Tape (CT); Number of Elements: 1; Manufacturer Part Number 1: NC7SV74K8X; RoHS: RoHS Compliant; Type: D-Type; Category: Integrated Circuits (ICs); Supplier Part Number 1: NC7SV74K8XCT-ND
IC22 = AD5601BKSZ-REEL7: Single 8-Bit nanoDAC with SPI Interface in LFCSP and SC70, 2.7 to 5.5 V, <100 uA, -40 to +125 degC, KS-6, Pb-Free, Reel; Generic Part Number: AD5601; Manufacturer: Analog Devices; Part Description: IC DAC 8BIT BUFF V-OUT SC70-6; # DAC Outputs: 1; Max V+: 5.5V; Op Pwr Diss: 550µW; Resolution (Bits): 8; Settling Time: 6µs; Single Supply: Yes; DatasheetVersion: Rev.F; PackageVersion: 072809-A; PackageReference: KS-6; PackageDescription: 6-Lead Thin Shrink Small Outline Transistor Package [SC70]; Supplier 1: Digi-Key; Supplier Part Number 1: AD5601BKSZ-REEL7TR-ND; Supplier 2: Digi-Key; Supplier Part Number 2: AD5601BKSZ-REEL7CT-ND; Supplier 3: Digi-Key; Supplier Part Number 3: AD5601BKSZ-REEL7DKR-ND; Supplier 4: Farnell; Supplier Part Number 4: 2312971; Supplier 5: Newark; Supplier Part Number 5: 59K4256; Supplier 6: Newark; Supplier Part Number 6: 67W3160; Supplier 7: Mouser; Supplier Part Number 7: 584-AD5601BKSZ-R7; Packing: Reel; RoHS: Y; Mounting Technology: Surface Mount; Code_JEDEC: MO-203-AB; PartNumber: AD5601BKSZ-REEL7; ComponentLink1Description: Manufacturer URL; ComponentLink1URL: http://www.analog.com/en/index.html; ComponentLink2Description: Datasheet; ComponentLink2URL: http://www.analog.com/static/imported-files/data_sheets/AD5601_5611_5621.pdf; ComponentLink3Description: Package Specification; ComponentLink3URL: http://www.analog.com/static/imported-files/packages/PKG_PDF/SC70(KS)/KS_6.pdf; ComponentLink4Description: Product URL; ComponentLink4URL: http://www.analog.com/en/digital-to-analog-converters/da-converters/ad5601/products/product.html
IC23 = ADF4002: Manufacturer: Analog Devices Inc; Manufacturer Part Number 1: ADF4002BCPZ-RL7; Part Description: IC PLL FREQUENCY SYNTH 20-LFCSP; Ratio - Input:Output: 2:1; Differential - Input:Output: Yes/No; Input: CMOS, TTL; Voltage - Supply: 2.7 V ~ 3.3 V; Supplier 1: Digi-Key; Supplier: Digi-Key; Category: Integrated Circuits (ICs); Type: Clock/Frequency Synthesizer (RF), Phase Detector; Operating Temperature: -40°C ~ 85°C; Mounting Type: Surface Mount; Package / Case: 20-VFQFN Exposed Pad, CSP; Supplier Part Number 1: ADF4002BCPZ-RL7CT-ND
IC24 = Si5351C: Manufacturer Part Number 1: SI5351C-B-GM; Part Description: IC CLK GENERATOR 200MHZ 20QFN; Manufacturer: Silicon Labs; Voltage - Supply: 1.71 V ~ 3.6 V; Input: Clock, Crystal; Ratio - Input:Output: 2:8; Frequency - Max: 160MHz; Supplier 1: Digi-Key; Supplier Device Package: 20-QFN (4x4); Type: Clock Generator; Package / Case: 20-VFQFN Exposed Pad; Category: Integrated Circuits (ICs); Supplier Part Number 1: 336-2402-ND
J18 J19 = RF_IF_connector: Manufacturer: Molex, LLC; Manufacturer Part Number 1: 0734120110; Part Description: CONN UMC RCPT STR 50 OHM SMD; Shield Termination: Solder; Frequency - Max: 6GHz; Impedance: 50 Ohm; Center Contact Material: Brass; Connector Style: Ultra Miniature Coaxial; Connector Type: Jack, Male Pin; Dielectric Material: Liquid Crystal Polymer (LCP); Center Contact Plating: Gold; Body Finish: Nickel; Body Material: Phosphor Bronze; Voltage Rating: 60V; Supplier 1: Digi-Key; Supplier Part Number 1: WM5587CT-ND; Ingress Protection: -; Category: Connectors, Interconnects; Mounting Type: Surface Mount; Packaging: Cut Tape (CT); Operating Temperature: -40°C ~ 90°C; Housing Color: Silver; Features: -; RoHS: RoHS Compliant; Cable Group: -; Fastening Type: Snap-On; Contact Termination: Solder
R136-R139 R141-R151 R155 R157 R158 = Res_0402: Manufacturer Part Number 1: RC0402JR-070RL; Manufacturer: Yageo; Part Description: RES SMD 0.0OHM JUMPER 1/16W 0402; Resistance (Ohms): 0.0; Tolerance: Jumper; Power (Watts): 0.063W, 1/16W; Value: 0R; Supplier 1: Digi-Key; Supplier Part Number 1: 311-0.0JRTR-ND; Category: Resistors; Temperature Coefficient: -; Features: Moisture Resistant; Supplier Device Package: 0402; Height: 0.016" (0.40mm); Package / Case: 0402 (1005 Metric); Operating Temperature: -55°C ~ 155°C; Size / Dimension: 0.039" L x 0.020" W (1.00mm x 0.50mm); Composition: Thick Film; Packaging: Tape & Reel (TR); Number of Terminations: 2; RoHS: RoHS Compliant
R140 R152 R159 R163-R165 = Res_0402: Manufacturer: Samsung Electro-Mechanics America, Inc.; Manufacturer Part Number: RC1005F49R9CS; Part Description: RES SMD 49.9 OHM 1% 1/16W 0402; Temperature Coefficient: ±100ppm/°C; Resistance (Ohms): 49.9; Power (Watts): 0.063W, 1/16W; Number of Terminations: 2; Size / Dimension: 0.039" L x 0.020" W (1.00mm x 0.50mm); Supplier Device Package: 0402 (1005 Metric); RoHS: RoHS Compliant; Supplier Part Number 1: 1276-3469-6-ND; Features: -; Packaging: Digi-Reel®; Tolerance: ±1%; Height: 0.016" (0.40mm); Category: Resistors; Composition: Thick Film; Package / Case: 0402 (1005 Metric); Supplier 1: Digi-Key; Operating Temperature: -55°C ~ 155°C; Value: 49.9R, 1%
R153 = Res_0402: Manufacturer Part Number 1: RC0402JR-0710RL; Manufacturer: Yageo; Part Description: RES SMD 10 OHM 5% 1/16W 0402; Power (Watts): 0.063W, 1/16W; Resistance (Ohms): 10; Temperature Coefficient: ±200ppm/°C; Value: 10R, 5%; Supplier 1: Digi-Key; Supplier Part Number 1: 311-10JRTR-ND; Number of Terminations: 2; Height: 0.016" (0.40mm); RoHS: RoHS Compliant; Composition: Thick Film; Packaging: Tape & Reel (TR); Category: Resistors; Supplier Device Package: 0402; Features: Moisture Resistant; Tolerance: ±5%; Operating Temperature: -55°C ~ 155°C; Size / Dimension: 0.039" L x 0.020" W (1.00mm x 0.50mm); Package / Case: 0402 (1005 Metric)
R154 = Res_0402: Manufacturer: Stackpole Electronics Inc; Manufacturer Part Number 1: RMCF0402FT1K00; Part Description: RES SMD 1K OHM 1% 1/16W 0402; Temperature Coefficient: ±100ppm/°C; Power (Watts): 0.063W, 1/16W; Value: 1k, 1%; Supplier 1: Digi-Key; Supplier Part Number 1: RMCF0402FT1K00TR-ND; Resistance (Ohms): 1k; Packaging: Tape & Reel (TR); Category: Resistors; RoHS: RoHS Compliant; Tolerance: ±1%; Height: 0.016" (0.40mm); Number of Terminations: 2; Package / Case: 0402 (1005 Metric); Operating Temperature: -55°C ~ 155°C; Features: -; Composition: Thick Film; Supplier Device Package: 0402; Size / Dimension: 0.039" L x 0.020" W (1.00mm x 0.50mm)
R156 = Res_0402: Manufacturer: Panasonic Electronic Components; Manufacturer Part Number 1: ERA-2AED471X; Part Description: RES SMD 470 OHM 0.5% 1/16W 0402; Power (Watts): 0.063W, 1/16W; Temperature Coefficient: ±25ppm/°C; Resistance (Ohms): 470; Value: 470R, 0.5%; Supplier 1: Digi-Key; Supplier Part Number 1: P470DETR-ND; Tolerance: ±0.5%; Packaging: Tape & Reel (TR); Number of Terminations: 2; Operating Temperature: -55°C ~ 155°C; RoHS: RoHS Compliant; Size / Dimension: 0.039" L x 0.020" W (1.00mm x 0.50mm); Composition: Thin Film; Package / Case: 0402 (1005 Metric); Height: 0.016" (0.40mm); Features: Automotive AEC-Q200; Supplier Device Package: 0402; Category: Resistors
R160 R161 = Res_0402: Manufacturer: Yageo; Manufacturer Part Number 1: RC0402FR-0710KL; Part Description: RES SMD 10K OHM 1% 1/16W 0402; Temperature Coefficient: ±100ppm/°C; Power (Watts): 0.063W, 1/16W; Value: 10k, 1%; Supplier 1: Digi-Key; Supplier Part Number 1: 311-10.0KLRTR-ND; Resistance (Ohms): 10k; Packaging: Tape & Reel (TR); RoHS: RoHS Compliant; Package / Case: 0402 (1005 Metric); Tolerance: ±1%; Operating Temperature: -55°C ~ 155°C; Size / Dimension: 0.039" L x 0.020" W (1.00mm x 0.50mm); Number of Terminations: 2; Category: Resistors; Height: 0.016" (0.40mm); Supplier Device Package: 0402; Features: Moisture Resistant; Composition: Thick Film
R162 = Res_0402: Manufacturer: Yageo; Manufacturer Part Number 1: RC0402JR-07330RL; Part Description: RES SMD 330 OHM 5% 1/16W 0402; Power (Watts): 0.063W, 1/16W; Resistance (Ohms): 330; Temperature Coefficient: ±100ppm/°C; Value: 330R, 5%; Supplier 1: Digi-Key; Supplier Part Number 1: 311-330JRTR-ND; Composition: Thick Film; Supplier Device Package: 0402; Package / Case: 0402 (1005 Metric); Size / Dimension: 0.039" L x 0.020" W (1.00mm x 0.50mm); Features: Moisture Resistant; Height: 0.016" (0.40mm); Packaging: Tape & Reel (TR); RoHS: RoHS Compliant; Tolerance: ±5%; Category: Resistors; Number of Terminations: 2; Operating Temperature: -55°C ~ 155°C
XO1 = RPT7050A: Manufacturer Part Number 1: E6245LF; Part Description: TCXO 30.72MHz, E6245LF; Manufacturer: Rakon; Supplier 1: Rakon; Supplier Part Number 1: E6245LF
XO2 = TXCO: Manufacturer Part Number 1: E5280LF; Part Description: TCXO 30.72MHz, E5280LF; Manufacturer: Rakon; Supplier 1: Rakon; Supplier Part Number 1: E5280LF
XT2 = CRYSTAL_19M2: Oscillator Crystal 25 MHz; Manufacturer Part Number 1: ABM8-25.000MHZ-B2-T; Manufacturer: ABRACON; Part Description: 25MHz ±20ppm Crystal 18pF 50 Ohm -20°C ~ 70°C Surface Mount 4-SMD, No Lead (DFN, LCC); Supplier 1: Newark; Supplier Part Number 1: 13J1767